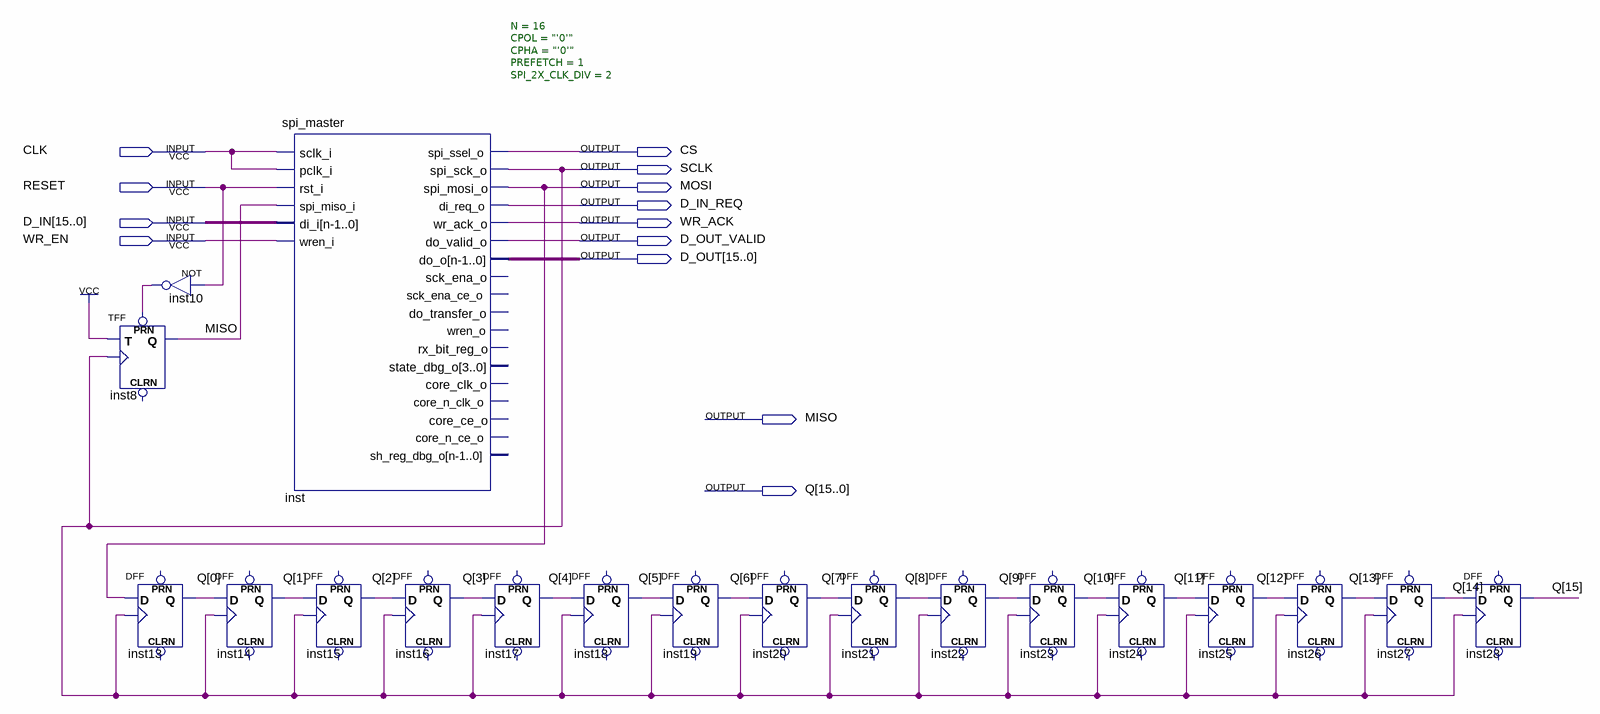
[diagram p0: schematic sheet]
// Quartus schematic test_spi_master_slave.bdf as structural Verilog: 19 symbols, 13 pins
module test_spi_master_slave (
  input  CLK,
  input  RESET,
  input  [15:0] D_IN,
  input  WR_EN,
  output CS,
  output SCLK,
  output MOSI,
  output D_IN_REQ,
  output WR_ACK,
  output D_OUT_VALID,
  output [15:0] D_OUT,
  output MISO,
  output [15:0] Q
);

  wire inst10_out;

  TFF inst8 (.PRN(inst10_out), .T(1'b1), .CLK(SCLK), .Q(MISO));  // open: CLRN
  not inst10 (inst10_out, RESET);
  DFF inst13 (.CLK(SCLK), .D(MOSI), .Q(Q[0]));  // open: CLRN, PRN
  DFF inst14 (.CLK(SCLK), .D(Q[0]), .Q(Q[1]));  // open: CLRN, PRN
  spi_master #(.N(16), .CPOL("'0'"), .CPHA("'0'"), .PREFETCH(1), .SPI_2X_CLK_DIV(2)) inst (
    .sclk_i(CLK), .pclk_i(CLK), .rst_i(RESET), .spi_miso_i(MISO), .di_i(D_IN), .wren_i(WR_EN),
    .spi_ssel_o(CS), .spi_sck_o(SCLK), .spi_mosi_o(MOSI), .di_req_o(D_IN_REQ), .wr_ack_o(WR_ACK),
    .do_valid_o(D_OUT_VALID), .do_o(D_OUT));  // open: sck_ena_o, sck_ena_ce_o, do_transfer_o, wren_o, rx_bit_reg_o, state_dbg_o, core_clk_o, core_n_clk_o, core_ce_o, core_n_ce_o, sh_reg_dbg_o
  DFF inst15 (.CLK(SCLK), .D(Q[1]), .Q(Q[2]));  // open: CLRN, PRN
  DFF inst16 (.CLK(SCLK), .D(Q[2]), .Q(Q[3]));  // open: CLRN, PRN
  DFF inst17 (.CLK(SCLK), .D(Q[3]), .Q(Q[4]));  // open: CLRN, PRN
  DFF inst18 (.CLK(SCLK), .D(Q[4]), .Q(Q[5]));  // open: CLRN, PRN
  DFF inst19 (.CLK(SCLK), .D(Q[5]), .Q(Q[6]));  // open: CLRN, PRN
  DFF inst20 (.CLK(SCLK), .D(Q[6]), .Q(Q[7]));  // open: CLRN, PRN
  DFF inst21 (.CLK(SCLK), .D(Q[7]), .Q(Q[8]));  // open: CLRN, PRN
  DFF inst22 (.CLK(SCLK), .D(Q[8]), .Q(Q[9]));  // open: CLRN, PRN
  DFF inst23 (.CLK(SCLK), .D(Q[9]), .Q(Q[10]));  // open: CLRN, PRN
  DFF inst24 (.CLK(SCLK), .D(Q[10]), .Q(Q[11]));  // open: CLRN, PRN
  DFF inst25 (.CLK(SCLK), .D(Q[11]), .Q(Q[12]));  // open: CLRN, PRN
  DFF inst26 (.CLK(SCLK), .D(Q[12]), .Q(Q[13]));  // open: CLRN, PRN
  DFF inst27 (.CLK(SCLK), .D(Q[13]), .Q(Q[14]));  // open: CLRN, PRN
  DFF inst28 (.CLK(SCLK), .D(Q[14]), .Q(Q[15]));  // open: CLRN, PRN
endmodule
